# EAGLE schematic MPU-9250-mbed_rev03_FDZ (EAGLE 9.2.2)
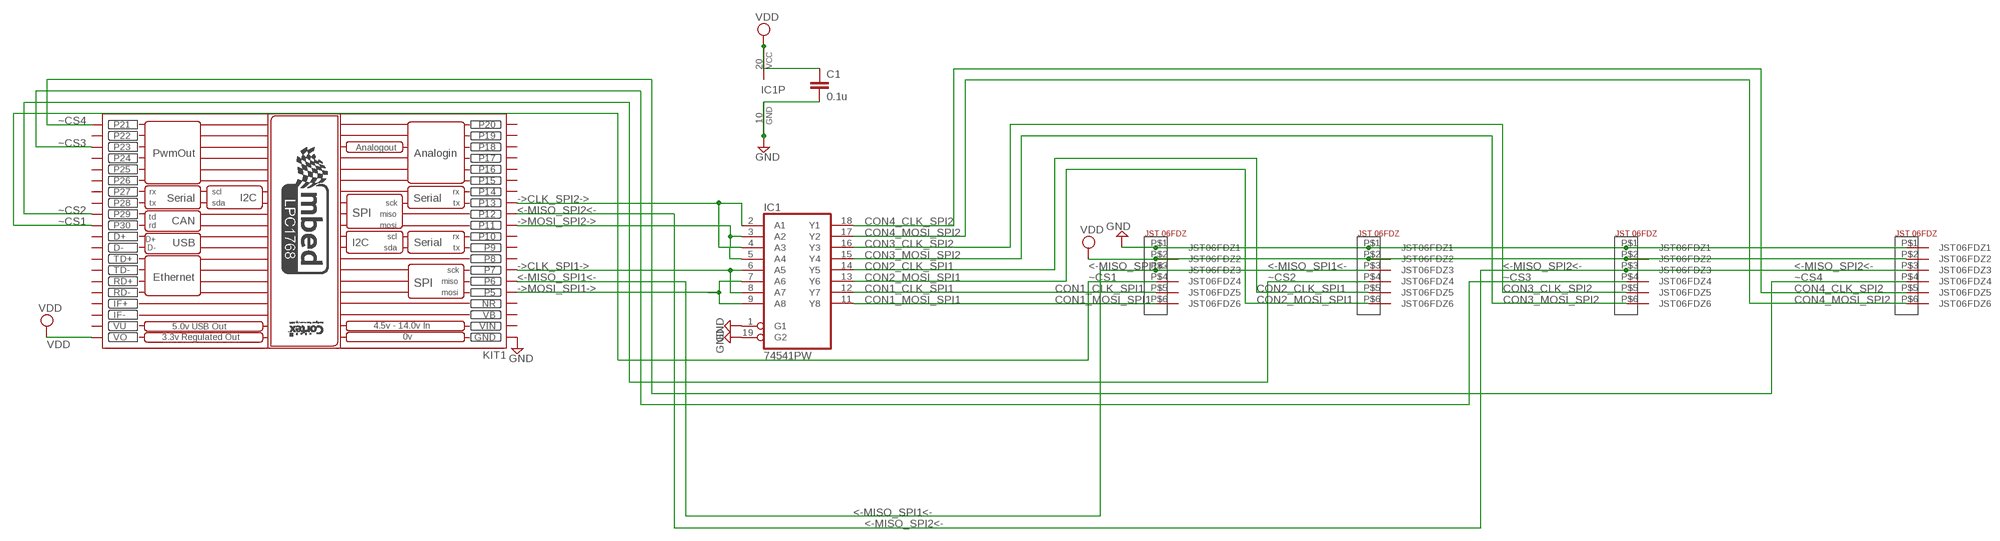
[diagram p0: schematic, sheet 1]

## Parts
C1  0.1u  C5/3  [C5B3]
CH0  CH0  06FDZ-ST(S)  [06FDZ-ST(S)]
IC1  74541PW  [TSSOP20]
KIT1  MBED_NXP_LPC1768  [MBED-KIT]
U$2  06FDZ-ST(S)  [06FDZ-ST(S)]
U$3  06FDZ-ST(S)  [06FDZ-ST(S)]
U$4  06FDZ-ST(S)  [06FDZ-ST(S)]

## Nets
->CLK_SPI1->: IC1.6(A5) IC1.8(A7) KIT1.P$7(P7)
->CLK_SPI2->: IC1.2(A1) IC1.4(A3) KIT1.P$13(P13)
->MOSI_SPI1->: IC1.7(A6) IC1.9(A8) KIT1.P$5(P5)
->MOSI_SPI2->: IC1.3(A2) IC1.5(A4) KIT1.P$11(P11)
<-MISO_SPI1<-: CH0.P$3(JST06FDZ3) KIT1.P$6(P6) U$2.P$3(JST06FDZ3)
<-MISO_SPI2<-: KIT1.P$12(P12) U$3.P$3(JST06FDZ3) U$4.P$3(JST06FDZ3)
CON1_CLK_SPI1: CH0.P$5(JST06FDZ5) IC1.12(Y7)
CON1_MOSI_SPI1: CH0.P$6(JST06FDZ6) IC1.11(Y8)
CON2_CLK_SPI1: IC1.14(Y5) U$2.P$5(JST06FDZ5)
CON2_MOSI_SPI1: IC1.13(Y6) U$2.P$6(JST06FDZ6)
CON3_CLK_SPI2: IC1.16(Y3) U$3.P$5(JST06FDZ5)
CON3_MOSI_SPI2: IC1.15(Y4) U$3.P$6(JST06FDZ6)
CON4_CLK_SPI2: IC1.18(Y1) U$4.P$5(JST06FDZ5)
CON4_MOSI_SPI2: IC1.17(Y2) U$4.P$6(JST06FDZ6)
GND: C1.2 CH0.P$1(JST06FDZ1) IC1.1(G1) IC1.10(GND) IC1.19(G2) KIT1.GND U$2.P$1(JST06FDZ1) U$3.P$1(JST06FDZ1) U$4.P$1(JST06FDZ1)
VDD: C1.1 CH0.P$2(JST06FDZ2) IC1.20(VCC) KIT1.VOUT(VO) U$2.P$2(JST06FDZ2) U$3.P$2(JST06FDZ2) U$4.P$2(JST06FDZ2)
~CS1: CH0.P$4(JST06FDZ4) KIT1.P$30(P30)
~CS2: KIT1.P$29(P29) U$2.P$4(JST06FDZ4)
~CS3: KIT1.P$23(P23) U$3.P$4(JST06FDZ4)
~CS4: KIT1.P$21(P21) U$4.P$4(JST06FDZ4)
Unconnected: KIT1.D+ KIT1.D- KIT1.IF+ KIT1.IF- KIT1.P$8(P8) KIT1.P$9(P9) KIT1.P$10(P10) KIT1.P$14(P14) KIT1.P$15(P15) KIT1.P$16(P16) KIT1.P$17(P17) KIT1.P$18(P18) KIT1.P$19(P19) KIT1.P$20(P20) KIT1.P$22(P22) KIT1.P$24(P24) KIT1.P$25(P25) KIT1.P$26(P26) KIT1.P$27(P27) KIT1.P$28(P28) KIT1.RD+ KIT1.RD- KIT1.TD+ KIT1.TD-

## Power pins joined to a net without a drawn wire
NR: KIT1.NR
VB: KIT1.VB
VIN: KIT1.VIN
VU: KIT1.VU

## Library data of the parts
C1 = capacitor-wima:C: CAPACITOR naming: grid - package width
CH0 U$2-U$4 = JST-con-FDZ:06FDZ-ST(S)
IC1 = 74xx-us:74*541: Octal BUFFER and LINE DRIVER, 3-state
KIT1 = MBED_v2.1:MBED_NXP_LPC1768: Mbed LPC1768 - ARM CORTEX v2.1 * Schematic symbol is now placed in eagles's default raster. *The pads diameter are suitable for routing between mbed pins * mbed pads are 0.8 mm drill diameter. --------------------------------------------- Created by: Mohamed Yousry *Alexandria, Egypt *Email: mohamed.yousry@ieeegoldegypt.org